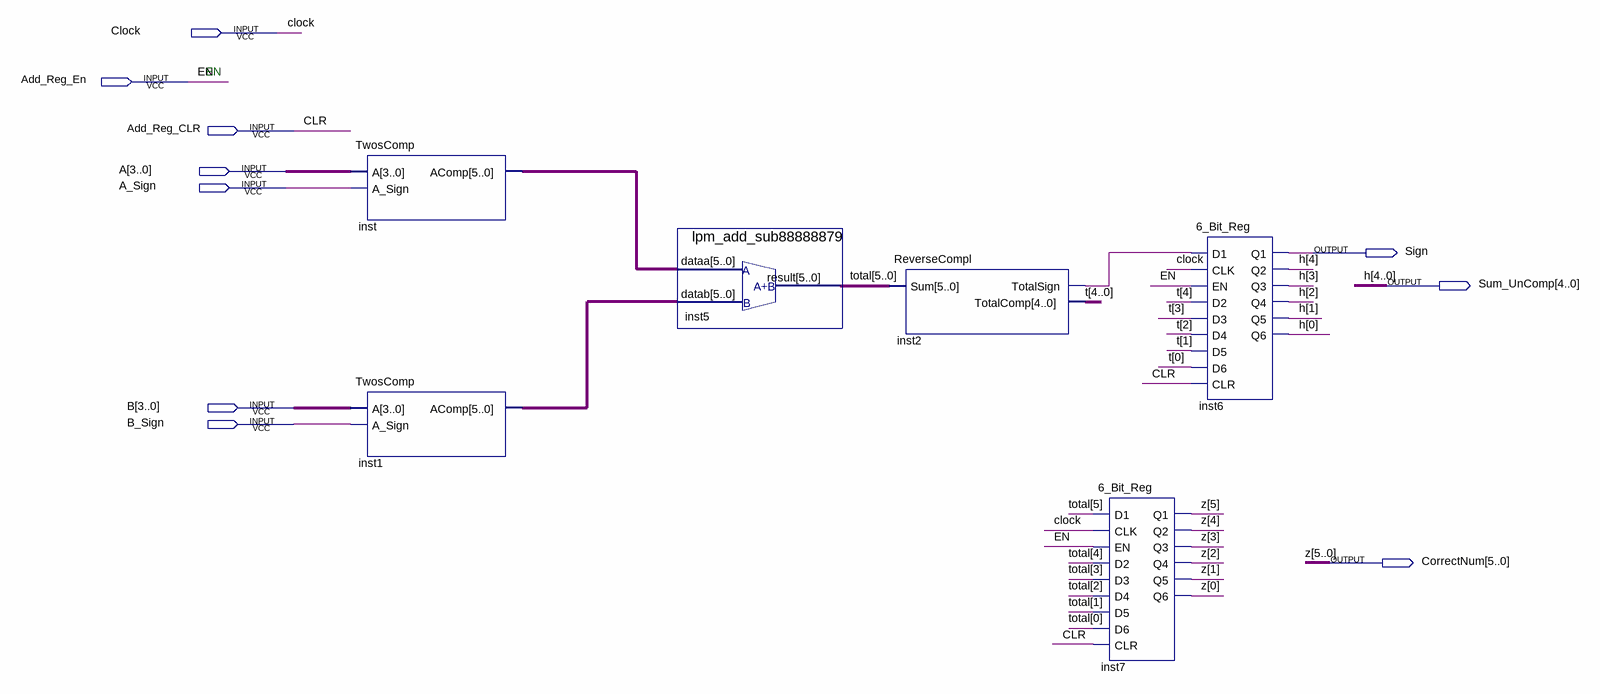
[diagram p0: schematic sheet]
// Quartus schematic AdderUnit.bdf as structural Verilog: 6 symbols, 10 pins
module AdderUnit (
  input  Clock,
  input  Add_Reg_En,
  input  Add_Reg_CLR,
  input  [3:0] A,
  input  A_Sign,
  input  [3:0] B,
  input  B_Sign,
  output Sign,
  output [4:0] Sum_UnComp,
  output [5:0] CorrectNum
);

  wire inst2_totalsign;
  wire [4:0] t;
  wire [5:0] inst1_acomp, inst_acomp, total;

  TwosComp inst (.A(A), .A_Sign(A_Sign), .AComp(inst_acomp));
  TwosComp inst1 (.A(B), .A_Sign(B_Sign), .AComp(inst1_acomp));
  lpm_add_sub88888879 inst5 (.dataa(inst_acomp), .datab(inst1_acomp), .result(total));
  ReverseCompl inst2 (.Sum(total), .TotalSign(inst2_totalsign), .TotalComp(t));
  \6_Bit_Reg  inst7 (
    .D1(total[5]), .CLK(Clock), .EN(Add_Reg_En), .D2(total[4]), .D3(total[3]), .D4(total[2]), .D5(total[1]),
    .D6(total[0]), .CLR(Add_Reg_CLR), .Q1(CorrectNum[5]), .Q2(CorrectNum[4]), .Q3(CorrectNum[3]),
    .Q4(CorrectNum[2]), .Q5(CorrectNum[1]), .Q6(CorrectNum[0]));
  \6_Bit_Reg  inst6 (
    .D1(inst2_totalsign), .CLK(Clock), .EN(Add_Reg_En), .D2(t[4]), .D3(t[3]), .D4(t[2]), .D5(t[1]),
    .D6(t[0]), .CLR(Add_Reg_CLR), .Q1(Sign), .Q2(Sum_UnComp[4]), .Q3(Sum_UnComp[3]), .Q4(Sum_UnComp[2]),
    .Q5(Sum_UnComp[1]), .Q6(Sum_UnComp[0]));

  // Other names for the same wires on the sheet: CLR = Add_Reg_CLR; EN = Add_Reg_En; h[4:0] = Sum_UnComp;
  //   z[5:0] = CorrectNum

  // Notes on the sheet:
  //   EN
endmodule
